# EAGLE design usbminib (EAGLE 6.4)
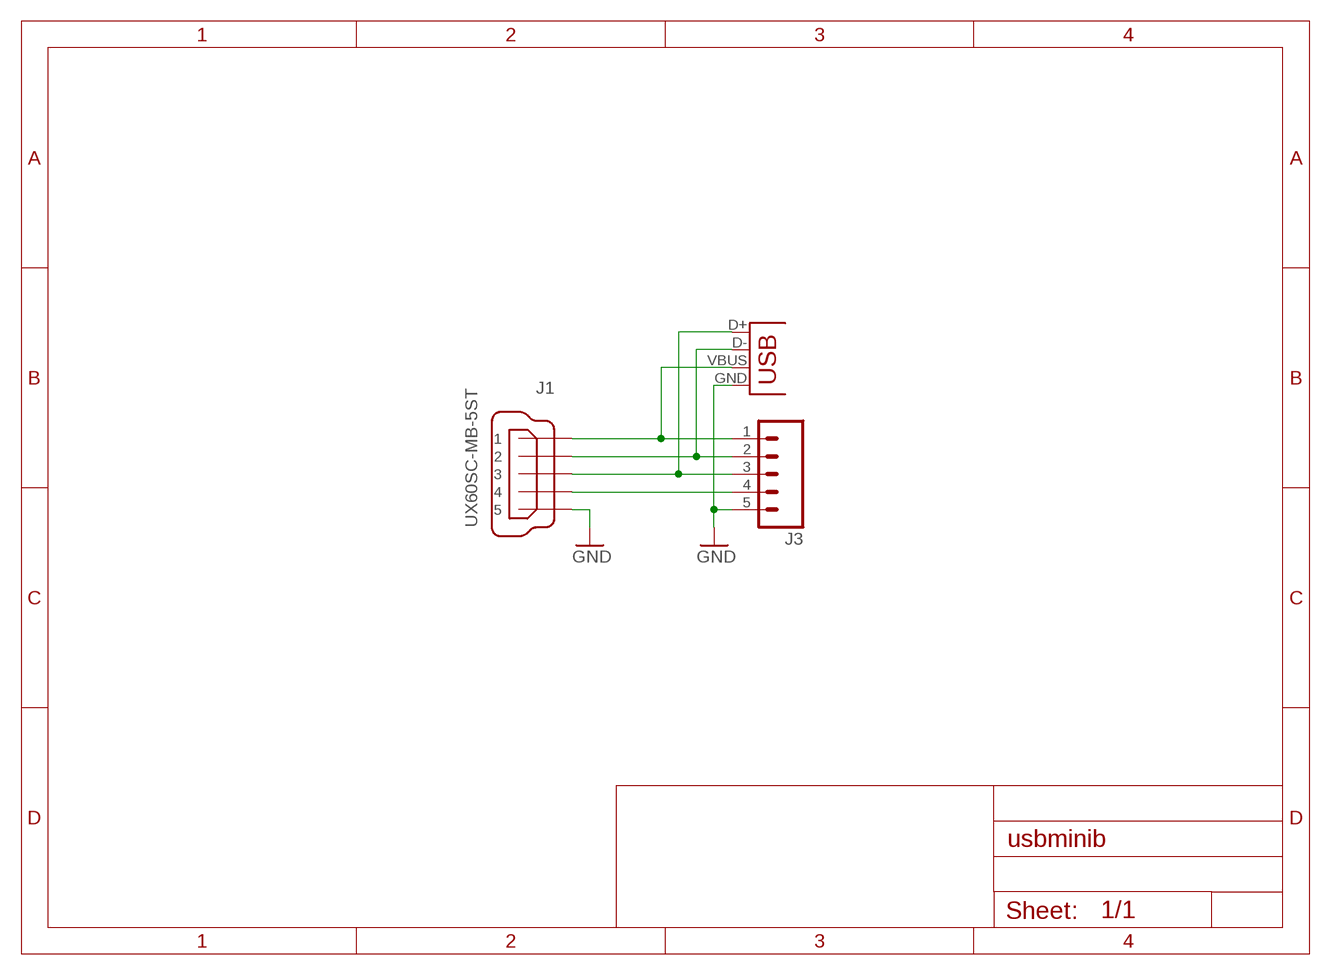
[diagram p0: schematic, sheet 1]

## Parts
J1  UX60SC-MB-5ST  [UX60SC-MB-5ST]
J2  USB-A-H  [USB-A-H]
J3  M05PTH  [1X05]

## Nets
GND [GND]: J1.5 J2.GND J3.5
N$2: J1.2 J2.D- J3.2
N$3: J1.3 J2.D+ J3.3
N$4: J1.4 J3.4
VBUS [VBUS]: J1.1 J2.VBUS J3.1

## Library data of the parts
J1 = usbminib:UX60SC-MB-5ST: Hirose UX60SC-MB-5ST ￼Mini-B Connectors, SMT mount receptacles meeting requirements of USB2.0 Standard UX60S Series Datasheet: e24000153.pdf <http://www.hirose.co.jp/cataloge_hp/e24000153.pdf> [hirose.co.jp]
J2 = mbed-connectors:USB: USB Connectors
J3 = SparkFun:M05: Header 5 Standard 5-pin 0.1" header. Use with straight break away headers (SKU : PRT-00116), right angle break away headers (PRT-00553), swiss pins (PRT-00743), machine pins (PRT-00117), and female headers (PRT-00115). Molex polarized connector foot print use with SKU : PRT-08230 with associated crimp pins and housings.

## Board
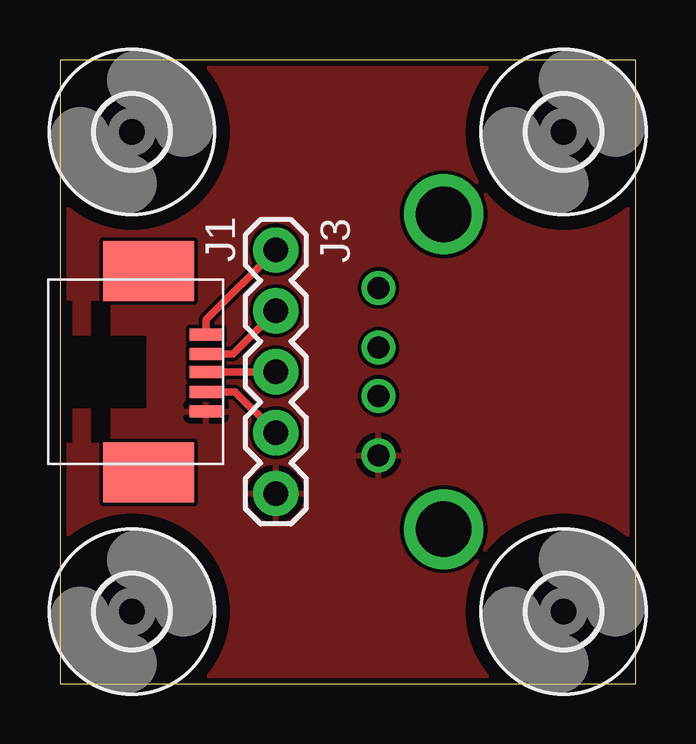
[diagram p1: board, top side]
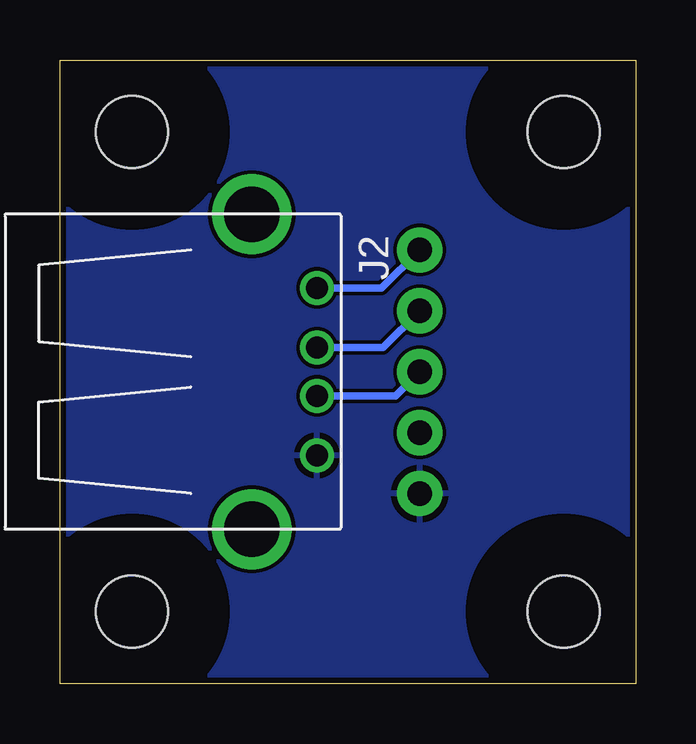
[diagram p2: board, bottom side, seen from below]

Size 24 x 26 mm. Coordinates in mm from the lower left corner, seen from the top.
Outline: 0,0 24,0 24,26 0,26 0,0
Copper layers (1*16): Top 0.035mm / dielectric 1.5mm / Bottom 0.035mm
Design rules "Fusion_eagle_rule_v1.1": minimum track width 6mil, minimum drill 12mil, track to track 6mil, track to pad 6mil, pad to pad 6mil, via to via 6mil, smd to smd 0mil, copper to edge 10mil, drill to drill 10mil, minimum pad ring 10mil, minimum via ring 6mil, stop-mask expansion 2mil, vias tented up to drill 100mil, thermal gap 10mil
tKeepout: area 0,0 to 6,6; area 18,0 to 24,6; area 18,20 to 24,26; area 0,20 to 6,26
bKeepout: area 0,20 to 6,26; area 0,0 to 6,6; area 18,0 to 24,6; area 18,20 to 24,26

### Footprints (pad centres in the part's own frame; a part is rotated, then mirrored left to right if it is on the bottom)
UX60SC-MB-5ST = smd 1.4 x 0.5: 1 6.1,1.55; 2 6.1,0.75; 3 6.1,0; 4 6.1,-0.85; 5 6.1,-1.65 | smd 3.8 x 2.5: M3 3.7,4.2; M4 3.7,-4.2
USB-A-H = drill 0.914: D+ 2.718,-1.003; D- 2.718,1.003; GND 2.718,-3.493; VBUS 2.718,3.493 | drill 2.311: P$5 0,-6.566; P$6 0,6.566
1X05 = drill 1.016 pad 1.88: 1 0,0; 2 2.54,0; 3 5.08,0; 4 7.62,0; 5 10.16,0
3,0 = hole 3: 0,0

### Placement (x,y rotation side)
J1  0,13 0 top
J2  16,13 0 bottom
J3  9,18.08 270 top
U$2  [3,0]  3,23 0 top
U$3  [3,0]  3,3 0 top
U$4  [3,0]  21,3 0 top
U$5  [3,0]  21,23 0 top

### Tracks (layer width: path | path; a pad name or v marks a point on that pad's centre or on a via)
GND
  pour Top: 0,26 24,26 24,0 0,0
  pour Bottom: 0,26 24,26 24,0 0,0
N$2
  Top 0.305: J3.2 7.21,13.75 J1.2
  Bottom 0.305: J3.2 10.54,14 J2.D-
N$3
  Top 0.305: J3.3 J1.3
  Bottom 0.305: J3.3 10,12 J2.D+
N$4
  Top 0.305: J3.4 7.31,12.15 J1.4
VBUS
  Top 0.305: J3.1 6.1,15.18 J1.1
  Bottom 0.305: J3.1 10.59,16.49 J2.VBUS